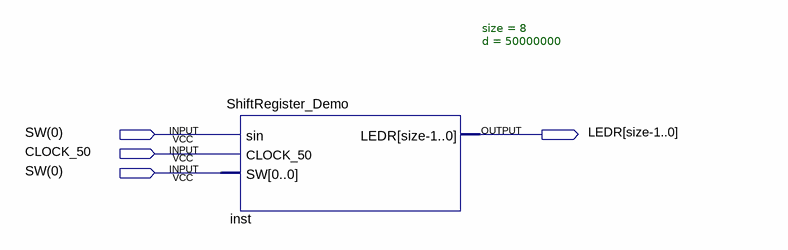
[diagram p0: schematic sheet]
// Quartus schematic ShiftRegister_Demo2.bdf as structural Verilog: 1 symbols, 4 pins
module ShiftRegister_Demo2 (
  input  \SW(0) ,
  input  CLOCK_50,
  output \LEDR[size-1..0] 
);

  ShiftRegister_Demo #(.size(8), .d(50000000)) inst (
    .sin(\SW(0) ), .CLOCK_50(CLOCK_50), .SW(\SW(0) ), .LEDR(\LEDR[size-1..0] ));
endmodule
